# EAGLE design BBBMS (EAGLE 6.3)

## Sheet 1 of 5
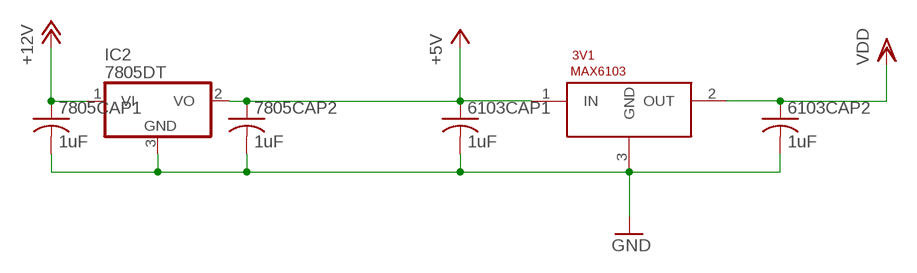
[diagram p0: schematic, sheet 1]

### Parts
3V1  MAX6103  [SOT23]
6103CAP1  1uF  C-USC1206  [C1206]
6103CAP2  1uF  C-USC1206  [C1206]
7805CAP1  1uF  C-USC1206  [C1206]
7805CAP2  1uF  C-USC1206  [C1206]
IC2  7805DT  [TO252]

### Nets
5V: 3V1.1(IN) 6103CAP1.1 7805CAP2.1 IC2.2(VO) ; supply symbol labelled +5V ; also sheet 5
12V: 7805CAP1.1 IC2.1(VI) ; supply symbol labelled +12V ; also sheet 2,3,4,5
GND: 3V1.3(GND) 6103CAP1.2 6103CAP2.2 7805CAP1.2 7805CAP2.2 IC2.3(GND) ; also sheet 2,3,4,5
VREF: 3V1.2(OUT) 6103CAP2.1 ; supply symbol labelled VDD ; also sheet 2,3

## Sheet 2 of 5
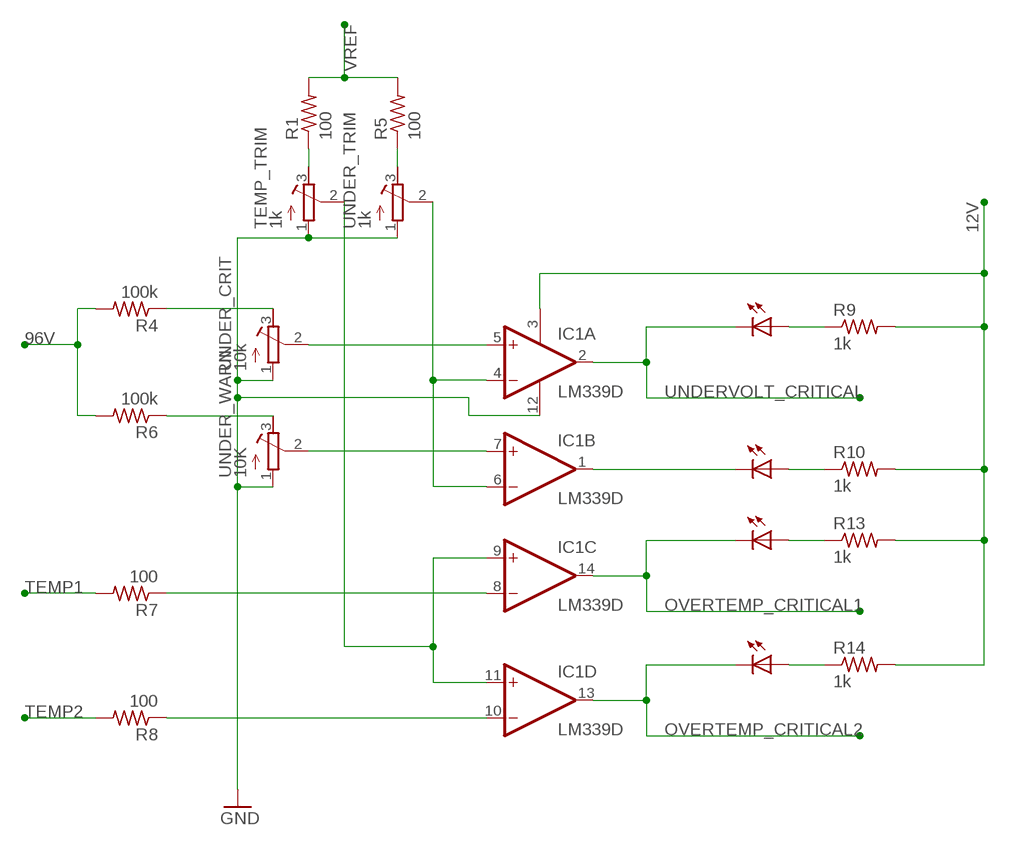
[diagram p1: schematic, sheet 2]

### Parts
IC1  LM339D  [SO14]
OVERTEMP1  TLLG4400  [LED3MM]
OVERTEMP2  TLLG4400  [LED3MM]
R1  100  R-US_R1206  [R1206]
R4  100k  R-US_R1206  [R1206]
R5  100  R-US_R1206  [R1206]
R6  100k  R-US_R1206  [R1206]
R7  100  R-US_R1206  [R1206]
R8  100  R-US_R1206  [R1206]
R9  1k  R-US_R1206  [R1206]
R10  1k  R-US_R1206  [R1206]
R13  1k  R-US_R1206  [R1206]
R14  1k  R-US_R1206  [R1206]
TEMP_TRIM  1k  R-TRIMM64W  [RTRIM64W]
UNDER_CRIT  10k  R-TRIMM64W  [RTRIM64W]
UNDER_TRIM  1k  R-TRIMM64W  [RTRIM64W]
UNDER_WARN  10K  R-TRIMM64W  [RTRIM64W]
UNDERVOLT  TLLG4400  [LED3MM]
UNDERVOLT_WARN  TLLG4400  [LED3MM]

### Nets
12V: IC1.3(P:V+) R9.2 R10.2 R13.2 R14.2 ; also sheet 1,3,4,5
96V: R4.2 R6.2 ; also sheet 3,5
GND: IC1.12(P:GND) TEMP_TRIM.1(A) UNDER_CRIT.1(A) UNDER_TRIM.1(A) UNDER_WARN.1(A) ; also sheet 1,3,4,5
N$2: IC1.8(C:-IN) R7.1
N$3: IC1.7(B:+IN) UNDER_WARN.2(S)
N$4: IC1.5(A:+IN) UNDER_CRIT.2(S)
N$5: IC1.9(C:+IN) IC1.11(D:+IN) TEMP_TRIM.2(S)
N$6: R6.1 UNDER_WARN.3(E)
N$8: IC1.10(D:-IN) R8.1
N$9: R4.1 UNDER_CRIT.3(E)
N$10: IC1.4(A:-IN) IC1.6(B:-IN) UNDER_TRIM.2(S)
N$11: R5.1 UNDER_TRIM.3(E)
N$12: R1.1 TEMP_TRIM.3(E)
N$14: R9.1 UNDERVOLT.A
N$15: R10.1 UNDERVOLT_WARN.A
N$16: OVERTEMP1.A R13.1
N$17: OVERTEMP2.A R14.1
OVERTEMP_CRITICAL1: IC1.14(C:OUT) OVERTEMP1.K(C) ; also sheet 4
OVERTEMP_CRITICAL2: IC1.13(D:OUT) OVERTEMP2.K(C) ; also sheet 4
TEMP1: R7.2 ; also sheet 5
TEMP2: R8.2 ; also sheet 5
UNDERVOLT_CRITICAL: IC1.2(A:OUT) UNDERVOLT.K(C) ; also sheet 4
UNDERVOLT_WARNING: IC1.1(B:OUT) UNDERVOLT_WARN.K(C)
VREF: R1.2 R5.2 ; also sheet 1,3

## Sheet 3 of 5
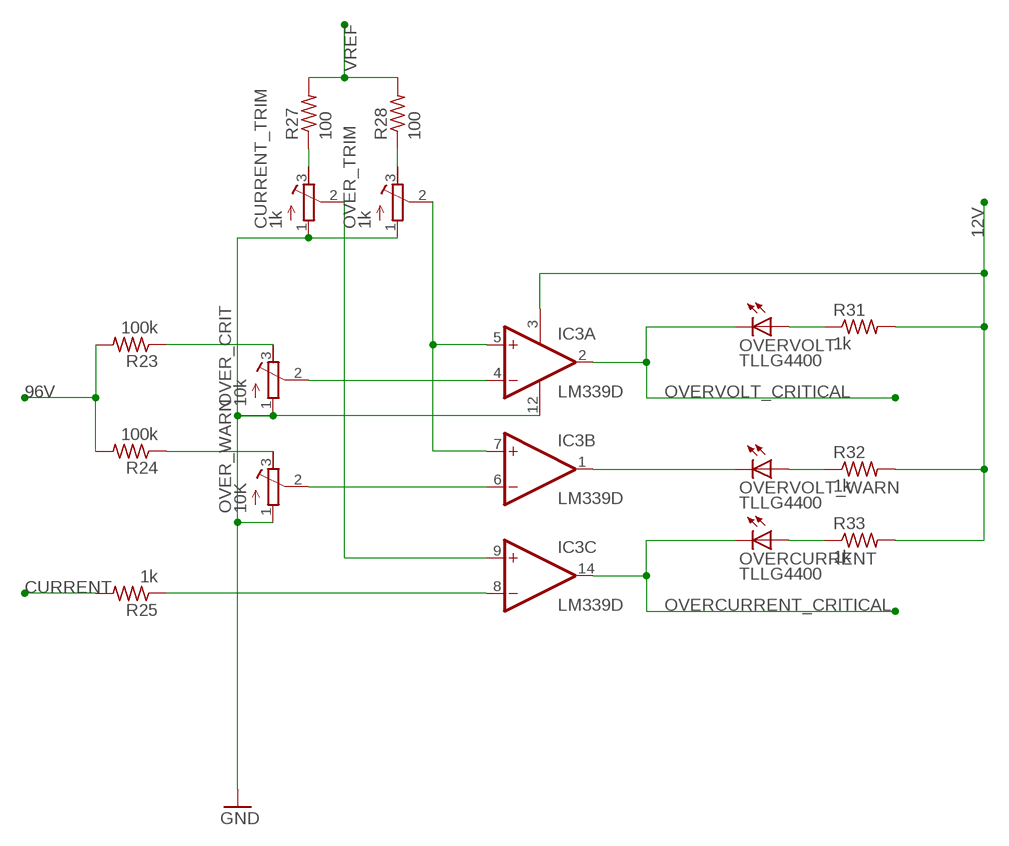
[diagram p2: schematic, sheet 3]

### Parts
CURRENT_TRIM  1k  R-TRIMM64W  [RTRIM64W]
IC3  LM339D  [SO14]
OVER_CRIT  10k  R-TRIMM64W  [RTRIM64W]
OVER_TRIM  1k  R-TRIMM64W  [RTRIM64W]
OVER_WARN  10K  R-TRIMM64W  [RTRIM64W]
OVERCURRENT  TLLG4400  [LED3MM]
OVERVOLT  TLLG4400  [LED3MM]
OVERVOLT_WARN  TLLG4400  [LED3MM]
R23  100k  R-US_R1206  [R1206]
R24  100k  R-US_R1206  [R1206]
R25  1k  R-US_R1206  [R1206]
R27  100  R-US_R1206  [R1206]
R28  100  R-US_R1206  [R1206]
R31  1k  R-US_R1206  [R1206]
R32  1k  R-US_R1206  [R1206]
R33  1k  R-US_R1206  [R1206]

### Nets
12V: IC3.3(P:V+) R31.2 R32.2 R33.2 ; also sheet 1,2,4,5
96V: R23.2 R24.2 ; also sheet 2,5
CURRENT: R25.2 ; also sheet 5
GND: CURRENT_TRIM.1(A) IC3.12(P:GND) OVER_CRIT.1(A) OVER_TRIM.1(A) OVER_WARN.1(A) ; also sheet 1,2,4,5
N$20: IC3.6(B:-IN) OVER_WARN.2(S)
N$21: IC3.4(A:-IN) OVER_CRIT.2(S)
N$22: CURRENT_TRIM.2(S) IC3.9(C:+IN)
N$23: OVER_CRIT.3(E) R23.1
N$24: OVER_WARN.3(E) R24.1
N$25: IC3.8(C:-IN) R25.1
N$27: IC3.5(A:+IN) IC3.7(B:+IN) OVER_TRIM.2(S)
N$28: OVER_TRIM.3(E) R28.1
N$29: CURRENT_TRIM.3(E) R27.1
N$30: OVERVOLT.A R31.1
N$31: OVERVOLT_WARN.A R32.1
N$32: OVERCURRENT.A R33.1
OVERCURRENT_CRITICAL: IC3.14(C:OUT) OVERCURRENT.K(C) ; also sheet 4
OVERVOLT_CRITICAL: IC3.2(A:OUT) OVERVOLT.K(C) ; also sheet 4
OVERVOLT_WARNING1: IC3.1(B:OUT) OVERVOLT_WARN.K(C)
VREF: R27.2 R28.2 ; also sheet 1,2
Unconnected: IC3.10(D:-IN) IC3.11(D:+IN) IC3.13(D:OUT)

## Sheet 4 of 5
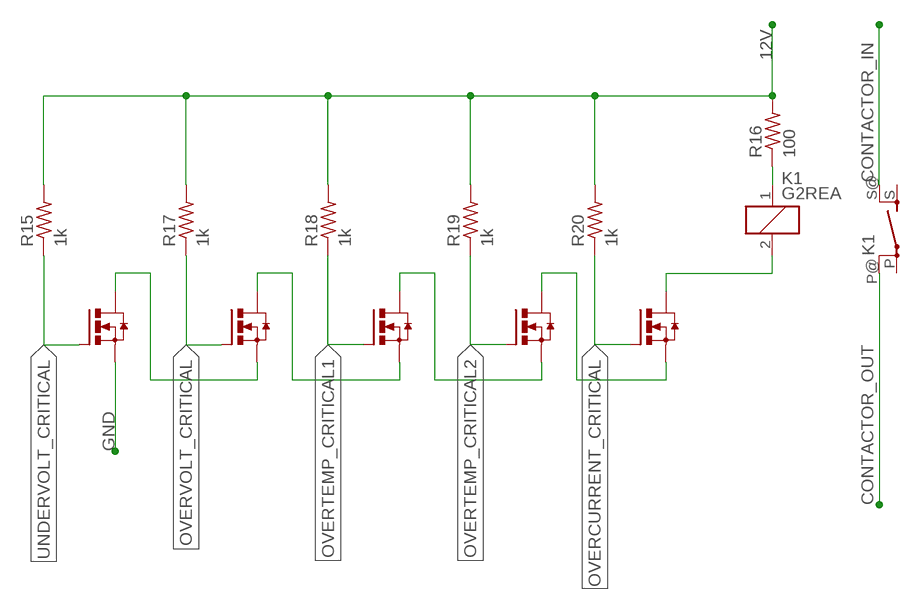
[diagram p3: schematic, sheet 4]

### Parts
K1  G2REA  [G2REA]
OVERCURRENT_FET  N-HEXFET-2D_SOT232-  [SOT223]
OVERTEMP1_FET  N-HEXFET-2D_SOT232-  [SOT223]
OVERTEMP2_FET  N-HEXFET-2D_SOT232-  [SOT223]
OVERVOLT_FET  N-HEXFET-2D_SOT232-  [SOT223]
R15  1k  R-US_R1206  [R1206]
R16  100  R-US_R1206  [R1206]
R17  1k  R-US_R1206  [R1206]
R18  1k  R-US_R1206  [R1206]
R19  1k  R-US_R1206  [R1206]
R20  1k  R-US_R1206  [R1206]
UNDERVOLT_FET  N-HEXFET-2D_SOT232-  [SOT223]

### Nets
12V: R15.2 R16.2 R17.2 R18.2 R19.2 R20.2 ; also sheet 1,2,3,5
CONTACTOR_IN: K1.S@(2:S) ; also sheet 5
CONTACTOR_OUT: K1.P@(2:P) ; also sheet 5
GND: UNDERVOLT_FET.3(S) ; also sheet 1,2,3,5
N$1: K1.2 OVERCURRENT_FET.2(D) OVERCURRENT_FET.4(D)
N$7: OVERCURRENT_FET.3(S) OVERTEMP2_FET.2(D) OVERTEMP2_FET.4(D)
N$13: K1.1 R16.1
N$18: OVERTEMP1_FET.2(D) OVERTEMP1_FET.4(D) OVERTEMP2_FET.3(S)
N$19: OVERTEMP1_FET.3(S) OVERVOLT_FET.2(D) OVERVOLT_FET.4(D)
N$26: OVERVOLT_FET.3(S) UNDERVOLT_FET.2(D) UNDERVOLT_FET.4(D)
OVERCURRENT_CRITICAL: OVERCURRENT_FET.1(G) R20.1 ; also sheet 3
OVERTEMP_CRITICAL1: OVERTEMP1_FET.1(G) R18.1 ; also sheet 2
OVERTEMP_CRITICAL2: OVERTEMP2_FET.1(G) R19.1 ; also sheet 2
OVERVOLT_CRITICAL: OVERVOLT_FET.1(G) R17.1 ; also sheet 3
UNDERVOLT_CRITICAL: R15.1 UNDERVOLT_FET.1(G) ; also sheet 2
Unconnected: K1.P(2:P) K1.S(2:S)

## Sheet 5 of 5
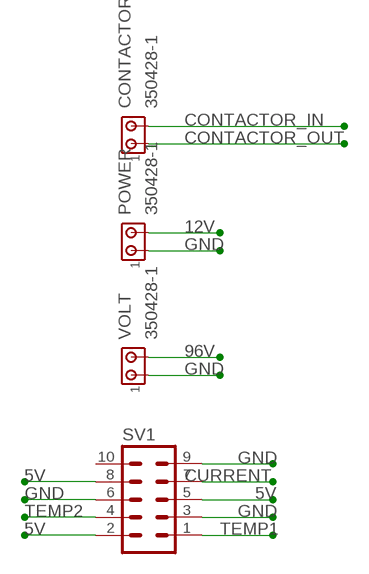
[diagram p4: schematic, sheet 5]

### Parts
CONTACTOR  350428-1  [350428-1]
POWER  350428-1  [350428-1]
SV1  MA05-2  [MA05-2]
VOLT  350428-1  [350428-1]

### Nets
5V: SV1.2 SV1.5 SV1.8 ; also sheet 1
12V: POWER.2 ; also sheet 1,2,3,4
96V: VOLT.2 ; also sheet 2,3
CONTACTOR_IN: CONTACTOR.2 ; also sheet 4
CONTACTOR_OUT: CONTACTOR.1 ; also sheet 4
CURRENT: SV1.7 ; also sheet 3
GND: POWER.1 SV1.3 SV1.6 SV1.9 VOLT.1 ; also sheet 1,2,3,4
TEMP1: SV1.1 ; also sheet 2
TEMP2: SV1.4 ; also sheet 2
Unconnected: SV1.10

## Library data of the parts
3V1 = SolarJacketsADC:MAX6103
6103CAP1 6103CAP2 7805CAP1 7805CAP2 = rcl:C-US: CAPACITOR, American symbol
CONTACTOR POWER VOLT = con-amp:350428-1: Universal MATE-N-LOK .250" Centerline, 600 V, 19 - 36 A max Source: http://catalog.tycoelectronics.com/ .. ENG_CD_350428_Y.pdf
CURRENT_TRIM OVER_CRIT OVER_TRIM OVER_WARN TEMP_TRIM UNDER_CRIT UNDER_TRIM UNDER_WARN = rcl:R-TRIMM: Trimm resistor
IC1 IC3 = linear:LM339: Low Power Low Offset Voltage Quad Comparators with open collector; LM139/LM239/LM339/LM2901/LM3302
IC2 = linear:78*: Positive VOLTAGE REGULATOR Source: http://cache.national.com/ds/LM/LM78L05.pdf http://www.fairchildsemi.com/ds/LM/LM7805.pdf
K1 = relay:G2REA: RELAY 1 x norm. open, high current, Omron; OC_FARNELL: unknown; OC_NEWARK: unknown
OVERCURRENT OVERTEMP1 OVERTEMP2 OVERVOLT OVERVOLT_WARN UNDERVOLT UNDERVOLT_WARN = led:TLLG4400: Low Current (2mA) LED 3 mm Tinted Diffused Package color GREEN Source: Data sheet <http://www.farnell.com/datasheets/391098.pdf>; MF: VISHAY SEMICONDUCTOR; OC_FARNELL: 1612435
OVERCURRENT_FET OVERTEMP1_FET OVERTEMP2_FET OVERVOLT_FET UNDERVOLT_FET = transistor-power:N-HEXFET-2D_?-*: HEXFET® Power MOSFET 2 Drain connects http://www.irf.com/product-info/datasheets/data/irll014n.pdf
R1 R4-R10 R13-R20 R23-R25 R27 R28 R31-R33 = rcl:R-US_: RESISTOR, American symbol
SV1 = con-lstb:MA05-2: PIN HEADER; OC_FARNELL: unknown; OC_NEWARK: unknown

## Board
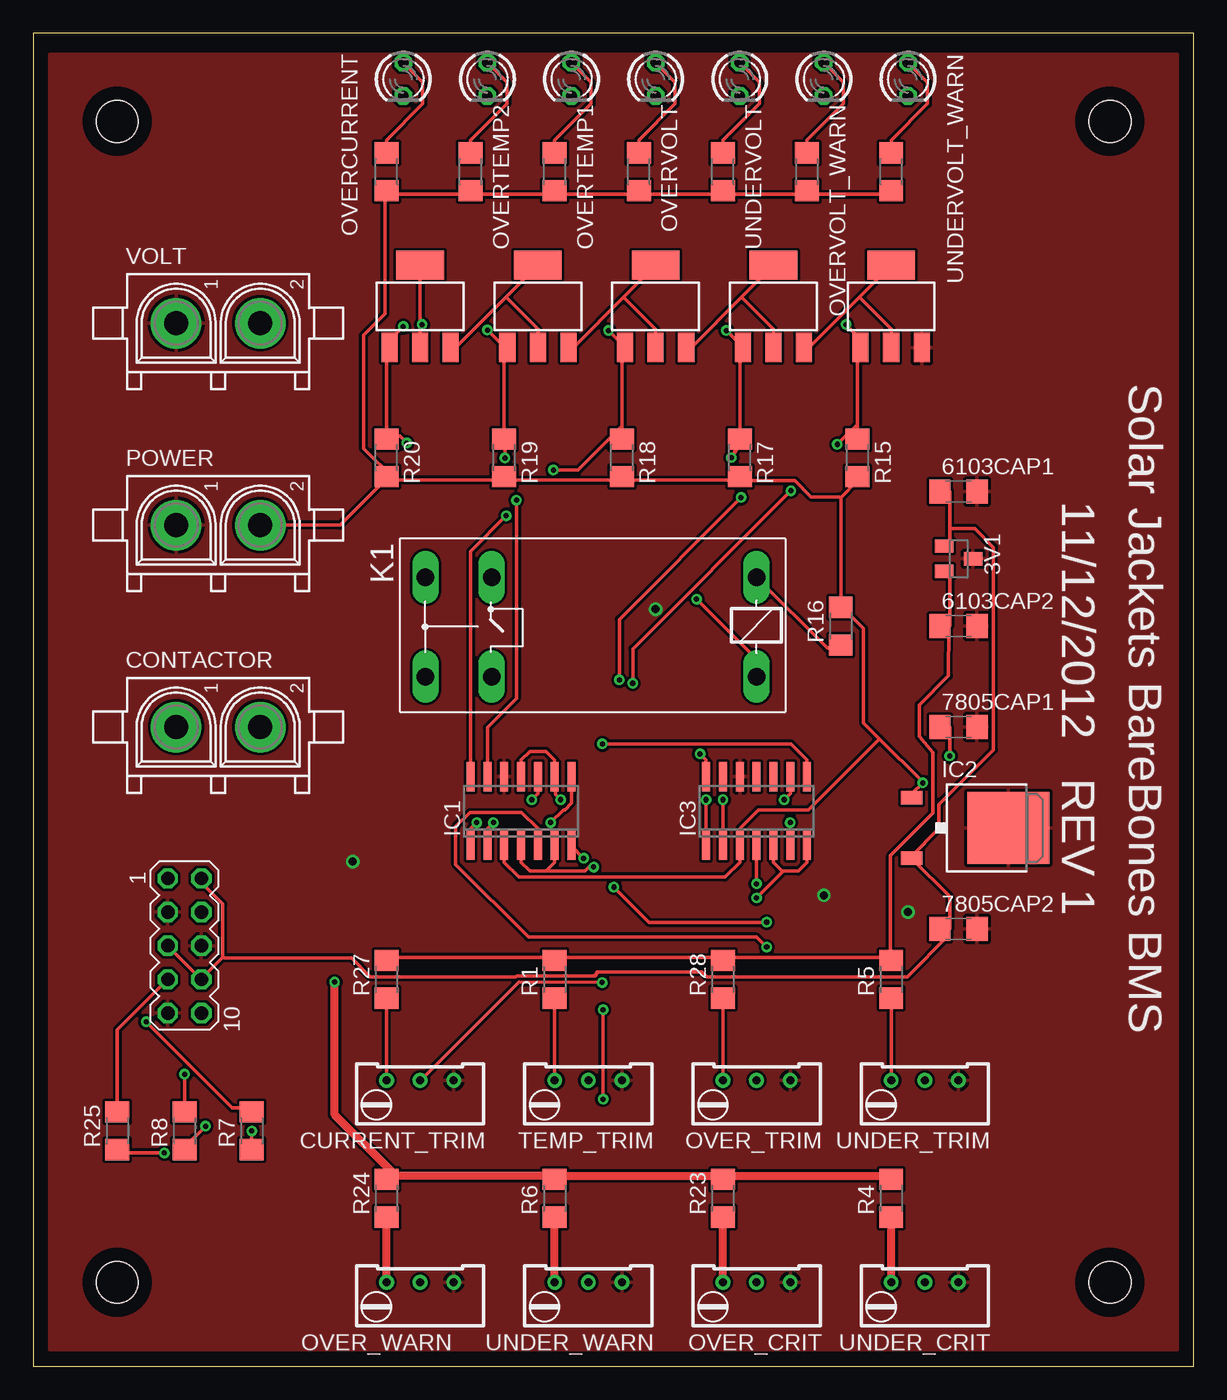
[diagram p5: board, top side]
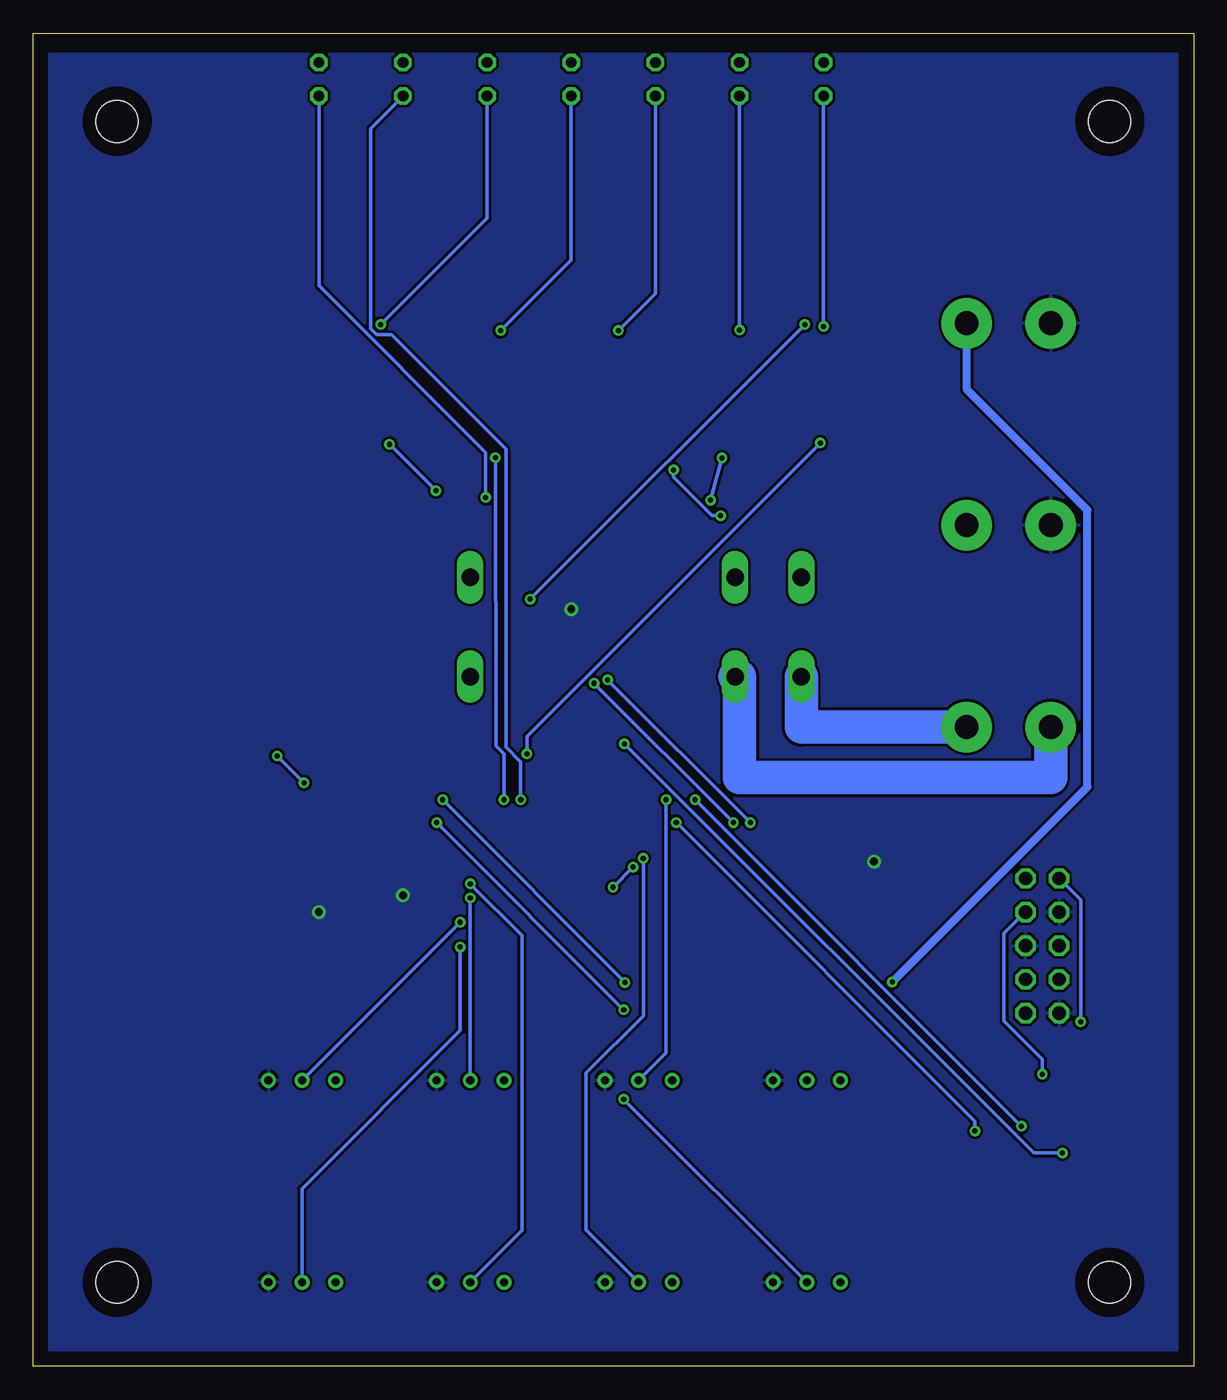
[diagram p6: board, bottom side, seen from below]

Size 87.61 x 100.64 mm. Coordinates in mm from the lower left corner, seen from the top.
Outline: 0,0 87.61,0 87.61,100.64 0,100.64 0,0
Copper layers (1*16): Top 0.035mm / dielectric 1.5mm / Bottom 0.035mm
Design rules "default": minimum track width 10mil, minimum drill 15mil, track to track 8mil, track to pad 8mil, pad to pad 8mil, via to via 8mil, smd to smd 8mil, copper to edge 40mil, drill to drill 8mil, minimum pad ring 10mil, minimum via ring 8mil, stop-mask expansion 4mil, vias tented up to drill 0mil, thermal gap 10mil
Holes 3.17 mm at 6.35,6.35 6.35,93.98 81.28,6.35 81.28,93.98

### Footprints (pad centres in the part's own frame; a part is rotated, then mirrored left to right if it is on the bottom)
SOT23 = smd 1 x 1.4: 1 -0.95,-1.1; 2 0.95,-1.1; 3 0,1.1
C1206 = smd 1.6 x 1.8: 1 -1.4,0; 2 1.4,0
350428-1 = drill 1.8 pad 3.81: 1 -3.175,0; 2 3.175,0
RTRIM64W = drill 0.61: 1 1.27,-2.54; 2 1.27,0; 3 1.27,2.54
SO14 = smd 0.6 x 2.2: 1 -3.81,-2.6; 2 -2.54,-2.6; 3 -1.27,-2.6; 4 0,-2.6; 5 1.27,-2.6; 6 2.54,-2.6; 7 3.81,-2.6; 8 3.81,2.6; 9 2.54,2.6; 10 1.27,2.6; 11 0,2.6; 12 -1.27,2.6; 13 -2.54,2.6; 14 -3.81,2.6
TO252 = smd 1 x 1.6: 1 -2.28,-4.8; 2 2.28,-4.8 | smd 5.4 x 6.2: 3 0,2.5
G2REA = drill 1.321 long: 1 -2.54,-3.683; 2 -2.54,3.81; P 17.45,-3.683; P@ 17.45,3.81; S 22.454,-3.683; S@ 22.454,3.81
LED3MM = drill 0.813 octagon: A -1.27,0; K 1.27,0
SOT223 = smd 1.219 x 2.235: 1 -2.311,-3.099; 2 0,-3.099; 3 2.311,-3.099 | smd 3.6 x 2.2: 4 0,3.099
R1206 = smd 1.6 x 1.803: 1 -1.422,0; 2 1.422,0
MA05-2 = drill 1.016 octagon: 1 -5.08,-1.27; 2 -5.08,1.27; 3 -2.54,-1.27; 4 -2.54,1.27; 5 0,-1.27; 6 0,1.27; 7 2.54,-1.27; 8 2.54,1.27; 9 5.08,-1.27; 10 5.08,1.27

### Placement (x,y rotation side)
3V1  69.85,60.96 270 top
6103CAP1  69.85,66.04 0 top
6103CAP2  69.85,55.88 0 top
7805CAP1  69.85,48.26 0 top
7805CAP2  69.85,33.02 0 top
CONTACTOR  13.97,48.26 0 top
CURRENT_TRIM  29.21,20.32 90 top
IC1  36.83,41.91 0 top
IC2  71.12,40.64 270 top
IC3  54.61,41.91 0 top
K1  52.07,55.88 180 top
OVER_CRIT  54.61,5.08 90 top
OVER_TRIM  54.61,20.32 90 top
OVER_WARN  29.21,5.08 90 top
OVERCURRENT  27.94,97.16 270 top
OVERCURRENT_FET  29.21,80.01 0 top
OVERTEMP1  40.64,97.16 270 top
OVERTEMP1_FET  46.99,80.01 0 top
OVERTEMP2  34.29,97.16 270 top
OVERTEMP2_FET  38.1,80.01 0 top
OVERVOLT  46.99,97.16 270 top
OVERVOLT_FET  55.88,80.01 0 top
OVERVOLT_WARN  59.69,97.16 270 top
POWER  13.97,63.5 0 top
R1  39.37,29.21 90 top
R4  64.77,12.7 90 top
R5  64.77,29.21 90 top
R6  39.37,12.7 90 top
R7  16.51,17.78 90 top
R8  11.43,17.78 90 top
R9  52.07,90.17 270 top
R10  64.77,90.17 270 top
R13  39.37,90.17 270 top
R14  33.02,90.17 270 top
R15  62.23,68.58 270 top
R16  60.96,55.88 90 top
R17  53.34,68.58 270 top
R18  44.45,68.58 270 top
R19  35.56,68.58 270 top
R20  26.67,68.58 270 top
R23  52.07,12.7 90 top
R24  26.67,12.7 90 top
R25  6.35,17.78 90 top
R27  26.67,29.21 90 top
R28  52.07,29.21 90 top
R31  45.72,90.17 270 top
R32  58.42,90.17 270 top
R33  26.67,90.17 270 top
SV1  11.43,31.75 270 top
TEMP_TRIM  41.91,20.32 90 top
UNDER_CRIT  67.31,5.08 90 top
UNDER_TRIM  67.31,20.32 90 top
UNDER_WARN  41.91,5.08 90 top
UNDERVOLT  53.34,97.16 270 top
UNDERVOLT_FET  64.77,80.01 0 top
UNDERVOLT_WARN  66.04,97.16 270 top
VOLT  13.97,78.74 0 top

### Tracks (layer width: path | path; a pad name or v marks a point on that pad's centre or on a via)
5V
  Top 0.254: SV1.5 SV1.8 12.75,29.31 14.33,30.89 | SV1.2 12.7,36.52 14.33,34.9 14.33,30.89 | 69.19,63.25 69.19,62.33 68.78,61.92 3V1.1 | 69.19,63.25 69.19,66.04 6103CAP1.1 | 69.19,63.25 71.07,63.25 72.49,61.82 72.49,46.53 68.38,42.42 68.38,40.59 66.24,38.46 IC2.2 66.29,38.35 69.19,35.46 69.19,33.02 7805CAP2.1 69.14,32.92 69.14,32.56 65.99,29.41 50.85,29.41 50.49,29.77 42.62,29.77 42.41,29.49 36.57,29.49 36.42,29.41 25.45,29.41 24.03,30.84 14.43,30.84 14.33,30.89
12V  (via drill 0.38)
  Top 0.254: IC1.3 35.56,38.05 36.68,36.93 52.22,36.93 53.34,38.05 IC3.3 53.39,39.42 53.39,40.64 54.76,42.01 58.52,42.01 63.88,47.37 | v69.19,46.08 69.19,48.26 7805CAP1.1 | IC2.1 66.35,42.93 66.35,43.23 v67.16,44.04 67.11,44.15 63.88,47.37 | 60.96,65.58 R16.2 60.91,57.45 62.69,55.68 62.69,48.56 63.88,47.37 | 60.96,65.58 62.23,66.85 R15.2 | R10.2 64.77,88.49 58.52,88.49 R32.2 58.42,88.49 52.17,88.49 R9.2 52.07,88.49 45.82,88.49 R31.2 45.72,88.49 39.47,88.49 R13.2 39.37,88.49 33.12,88.49 R14.2 33.02,88.49 26.67,88.49 R33.2 26.57,88.39 26.57,79.45 24.94,77.83 24.94,69.29 27.23,67 R20.2 | R20.2 26.67,66.9 35.56,66.9 R19.2 35.66,66.9 44.45,66.9 R18.2 44.55,66.9 53.34,66.9 R17.2 53.44,66.85 57.51,66.85 58.73,65.63 60.86,65.63 60.96,65.58 | POWER.2 23.17,63.5 26.57,66.9 R20.2
  Bottom 0.254: v67.16,44.04 v69.19,46.08
96V  (via drill 0.38)
  Top 0.254: 26.67,14.38 R24.2 27.28,14.48 | 39.37,14.38 R6.2 39.47,14.38 | 52.07,14.38 R23.2 52.17,14.38 | 64.77,14.38 R4.2
  Top 0.61: 39.37,14.38 26.67,14.38 | 39.47,14.38 52.07,14.38 | 52.17,14.38 64.77,14.38 | v22.76,29.01 22.76,19 27.28,14.48
  Bottom 0.254: 17.12,78.74 VOLT.2
  Bottom 0.61: 17.12,78.74 17.12,73.71 8.03,64.62 8.03,43.74 v22.76,29.01
CONTACTOR_IN
  Bottom 2.54: CONTACTOR.2 29.62,48.26 K1.S@
CONTACTOR_OUT
  Bottom 2.54: K1.P@ 34.29,52.07 34.29,44.45 10.8,44.45 CONTACTOR.1
CURRENT
  Top 0.254: R25.2 6.35,25.4 SV1.7
GND  (via drill 0.6)
  other vias: 59.69,35.56 46.99,57.15 66.04,34.29 24.13,38.1
  pour Top: 1.27,99.06 1.27,1.27 86.36,1.27 86.36,99.06
  pour Bottom: 1.27,99.06 1.27,1.27 86.36,1.27 86.36,99.06
N$1  (via drill 0.38)
  Top 0.254: OVERCURRENT_FET.4 29.21,78.64 | 29.21,78.64 OVERCURRENT_FET.2 | K1.2 54.61,53.39 v50.09,57.91 | v29.36,78.64 29.21,78.64
  Bottom 0.254: v29.36,78.64 v50.09,57.91
N$2  (via drill 0.38)
  Top 0.254: v16.51,17.77 R7.1 | v39.07,41.05 40.03,42.01 40.13,42.01 40.64,42.52 IC1.8
  Bottom 0.254: v16.51,17.77 16.51,18.49 v39.07,41.05
N$3  (via drill 0.38)
  Top 0.254: v41.55,38.35 40.64,39.27 IC1.7
  Bottom 0.254: v41.55,38.35 41.55,26.47 45.87,22.15 45.87,10.31 UNDER_WARN.2
N$4  (via drill 0.38)
  Top 0.254: IC1.5 38.1,40.59 36.88,41.81 32.97,41.81 31.9,40.74 31.9,37.9 37.39,32.41 54.61,32.41 v55.37,31.65
  Bottom 0.254: v55.37,31.65 55.37,25.35 67.31,13.41 UNDER_CRIT.2
N$5  (via drill 0.38)
  Top 0.254: IC1.11 36.83,45.77 37.49,46.43 38.71,46.43 39.37,45.77 IC1.9 39.42,44.4 39.42,43.18 v39.83,42.77
  Bottom 0.254: TEMP_TRIM.2 39.83,23.67 v39.83,42.77
N$6
  Top 0.61: UNDER_WARN.3 R6.1
N$7
  Top 0.254: OVERTEMP2_FET.4 35.69,80.7 | 35.69,80.7 31.9,76.91 31.55,76.91 OVERCURRENT_FET.3 | OVERTEMP2_FET.4 | OVERTEMP2_FET.2 38.1,78.28 35.69,80.7
N$8  (via drill 0.38)
  Top 0.254: R8.1 11.43,16.56 v13.01,18.13 | v37.64,42.77 38.1,43.23 IC1.10
  Bottom 0.254: v37.64,42.77 v13.01,18.13
N$9
  Top 0.61: UNDER_CRIT.3 R4.1
N$10  (via drill 0.38)
  Top 0.254: IC1.4 36.83,38.05 37.49,37.39 38.71,37.39 38.79,37.47 | 38.79,37.47 39.37,38.05 IC1.6 | v55.37,33.53 46.48,33.53 v43.84,36.17 | v42.32,37.69 41.96,37.69 41.66,37.39 38.86,37.39 38.79,37.47
  Bottom 0.254: v55.37,33.53 UNDER_TRIM.2 | v42.32,37.69 v43.84,36.17
N$11
  Top 0.254: UNDER_TRIM.3 R5.1
N$12
  Top 0.254: TEMP_TRIM.3 R1.1
N$13
  Top 0.254: R16.1 60.96,54.2 59.94,54.2 54.61,59.54 K1.1
N$14
  Top 0.254: R9.1 52.07,92.56 54.81,95.3 54.81,96.93 53.34,98.4 UNDERVOLT.A
N$15
  Top 0.254: R10.1 64.77,92.56 67.51,95.3 67.51,96.93 66.04,98.4 UNDERVOLT_WARN.A
N$16
  Top 0.254: R13.1 39.37,92.56 42.11,95.3 42.11,96.93 40.64,98.4 OVERTEMP1.A
N$17
  Top 0.254: R14.1 33.02,92.56 35.76,95.3 35.76,96.93 34.29,98.4 OVERTEMP2.A
N$18
  Top 0.254: OVERTEMP1_FET.4 44.58,80.7 | 44.58,80.7 40.79,76.91 40.44,76.91 OVERTEMP2_FET.3 | OVERTEMP1_FET.4 | OVERTEMP1_FET.2 46.99,78.28 44.58,80.7
N$19
  Top 0.254: OVERVOLT_FET.4 53.47,80.7 | 53.47,80.7 49.68,76.91 49.33,76.91 OVERTEMP1_FET.3 | OVERVOLT_FET.4 | OVERVOLT_FET.2 55.88,78.28 53.47,80.7
N$20  (via drill 0.38)
  Top 0.254: v57.15,41.05 IC3.6 | v43.03,20.17 v43.03,26.92
  Bottom 0.254: v43.03,26.92 v57.15,41.05 | OVER_WARN.2 v43.03,20.17
N$21  (via drill 0.38)
  Top 0.254: v54.61,36.42 IC3.4
  Bottom 0.254: v54.61,36.42 50.7,32.51 50.7,10.26 OVER_CRIT.2
N$22  (via drill 0.38)
  Top 0.254: IC3.9 57.15,43.23 v56.69,42.77 | v42.95,28.98 36.68,29.01 29.26,21.59 CURRENT_TRIM.2
  Bottom 0.254: v42.95,28.98 v56.69,42.77
N$23
  Top 0.61: OVER_CRIT.3 R23.1
N$24
  Top 0.61: OVER_WARN.3 R24.1
N$25  (via drill 0.38)
  Top 0.254: v9.91,16.1 6.35,16.1 R25.1 | v42.98,46.99 57.2,46.99 58.42,45.77 IC3.8
  Bottom 0.254: v9.91,16.1 12.09,16.1 v42.98,46.99
N$26
  Top 0.254: UNDERVOLT_FET.4 62.36,80.7 | 62.36,80.7 58.57,76.91 58.22,76.91 OVERVOLT_FET.3 | UNDERVOLT_FET.4 | UNDERVOLT_FET.2 64.77,78.28 62.36,80.7
N$27  (via drill 0.38)
  Top 0.254: IC3.5 55.88,38.05 56.54,37.39 | 56.54,37.39 57.76,37.39 58.42,38.05 IC3.7 | v54.61,35.36 56.54,37.29 56.54,37.39
  Bottom 0.254: v54.61,35.36 OVER_TRIM.2
N$28
  Top 0.254: OVER_TRIM.3 R28.1
N$29
  Top 0.254: CURRENT_TRIM.3 R27.1
N$30
  Top 0.254: R31.1 45.72,92.56 48.46,95.3 48.46,96.93 46.99,98.4 OVERVOLT.A
N$31
  Top 0.254: R32.1 58.42,92.56 61.16,95.3 61.16,96.93 59.69,98.4 OVERVOLT_WARN.A
N$32
  Top 0.254: R33.1 26.67,92.56 29.41,95.3 29.41,96.93 27.94,98.4 OVERCURRENT.A
OVERCURRENT_CRITICAL  (via drill 0.38)
  Top 0.254: IC3.14 50.8,45.77 v50.34,46.23 | v28.19,69.7 27.69,70.21 26.77,70.21 R20.1 26.67,76.66 26.87,76.86 OVERCURRENT_FET.1 26.98,77.01 26.98,77.52 v27.94,78.49
  Bottom 0.254: v50.34,46.23 50.34,47.55 v28.19,69.7 | v27.94,78.49 OVERCURRENT.K
OVERTEMP_CRITICAL1  (via drill 0.38)
  Top 0.254: IC1.14 33.02,61.52 v35.71,64.21 | v39.27,67.67 41.15,67.67 44.35,70.87 R18.1 44.45,76.66 44.65,76.86 OVERTEMP1_FET.1 44.6,77.01 v43.43,78.18
  Bottom 0.254: v35.71,64.21 36.37,64.21 39.27,67.11 v39.27,67.67 | OVERTEMP1.K 40.64,80.97 v43.43,78.18
OVERTEMP_CRITICAL2  (via drill 0.38)
  Top 0.254: IC1.13 34.29,48.21 36.47,50.39 v36.47,65.38 | v35.61,68.56 35.61,69.8 35.61,70.16 R19.1 35.56,76.66 35.76,76.86 OVERTEMP2_FET.1 35.66,76.86 v34.29,78.23
  Bottom 0.254: v35.61,68.56 v36.47,65.38 | v34.29,78.23 OVERTEMP2.K
OVERVOLT_CRITICAL  (via drill 0.38)
  Top 0.254: v52.07,42.77 IC3.2 | v52.71,68.6 53.29,69.55 53.29,70.16 R17.1 53.34,76.66 53.54,76.86 OVERVOLT_FET.1 53.49,77.01 v52.32,78.18
  Bottom 0.254: v52.07,42.77 52.07,46.23 52.68,46.84 v52.71,68.6 | OVERVOLT.K 46.99,83.52 v52.32,78.18
OVERVOLT_WARNING1  (via drill 0.38)
  Top 0.254: v50.8,42.77 IC3.1
  Bottom 0.254: v50.8,42.77 50.8,45.62 51.92,46.74 51.92,69.24 60.55,77.88 61.67,77.88 62.13,78.33 62.13,93.42 59.69,95.86 OVERVOLT_WARN.K
TEMP1  (via drill 0.38)
  Top 0.254: v8.53,26.01 15.04,19.51 16.51,19.51 R7.2
  Bottom 0.254: v8.53,26.01 8.53,35.2 SV1.1
TEMP2  (via drill 0.38)
  Top 0.254: v11.43,22.05 R8.2
  Bottom 0.254: v11.43,22.05 11.43,23.16 14.33,26.06 14.33,32.66 SV1.4
UNDERVOLT_CRITICAL  (via drill 0.38)
  Top 0.254: 62.23,71.02 62.23,76.66 62.43,76.86 UNDERVOLT_FET.1 62.38,77.01 62.38,77.62 v61.37,78.64 | 62.23,71.02 R15.1 | IC1.2 34.29,40.59 v34.75,41.05 | v45.26,51.56 45.26,54.15 v57.2,66.09 | v60.71,69.6 62.13,71.02 62.23,71.02
  Bottom 0.254: v45.26,51.56 v34.75,41.05 | v60.71,69.6 v57.2,66.09 | UNDERVOLT.K 53.34,86.67 v61.37,78.64
UNDERVOLT_WARNING  (via drill 0.38)
  Top 0.254: IC1.1 33.02,40.59 v33.48,41.05 | v44.25,51.82 44.25,56.39 v53.44,65.58
  Bottom 0.254: v44.25,51.82 v33.48,41.05 | v53.44,65.58 53.44,68.99 66.04,81.58 UNDERVOLT_WARN.K
VREF
  Top 0.254: 3V1.2 68.78,59.99 69.19,59.59 69.19,55.88 6103CAP2.1 69.14,55.78 69.1,52.15 66.88,49.93 66.9,47.53 67.92,46.35 67.92,41.76 64.72,38.56 64.72,30.99 R5.2 64.77,30.89 52.17,30.89 R28.2 52.07,30.89 39.47,30.89 R1.2 39.37,30.89 26.67,30.89 R27.2

### Text on the board
tNames: Solar Jackets BareBones BMS / 11/12/2012 REV 1
tValues: Gnd | 96V | Gnd | 12V | Out | In | TEMP1 | 5V | Gnd | TEMP2 | Gnd | 5V | CURR | 5V | Gnd